# EAGLE design powerboard_v1 (EAGLE 7.2.0)
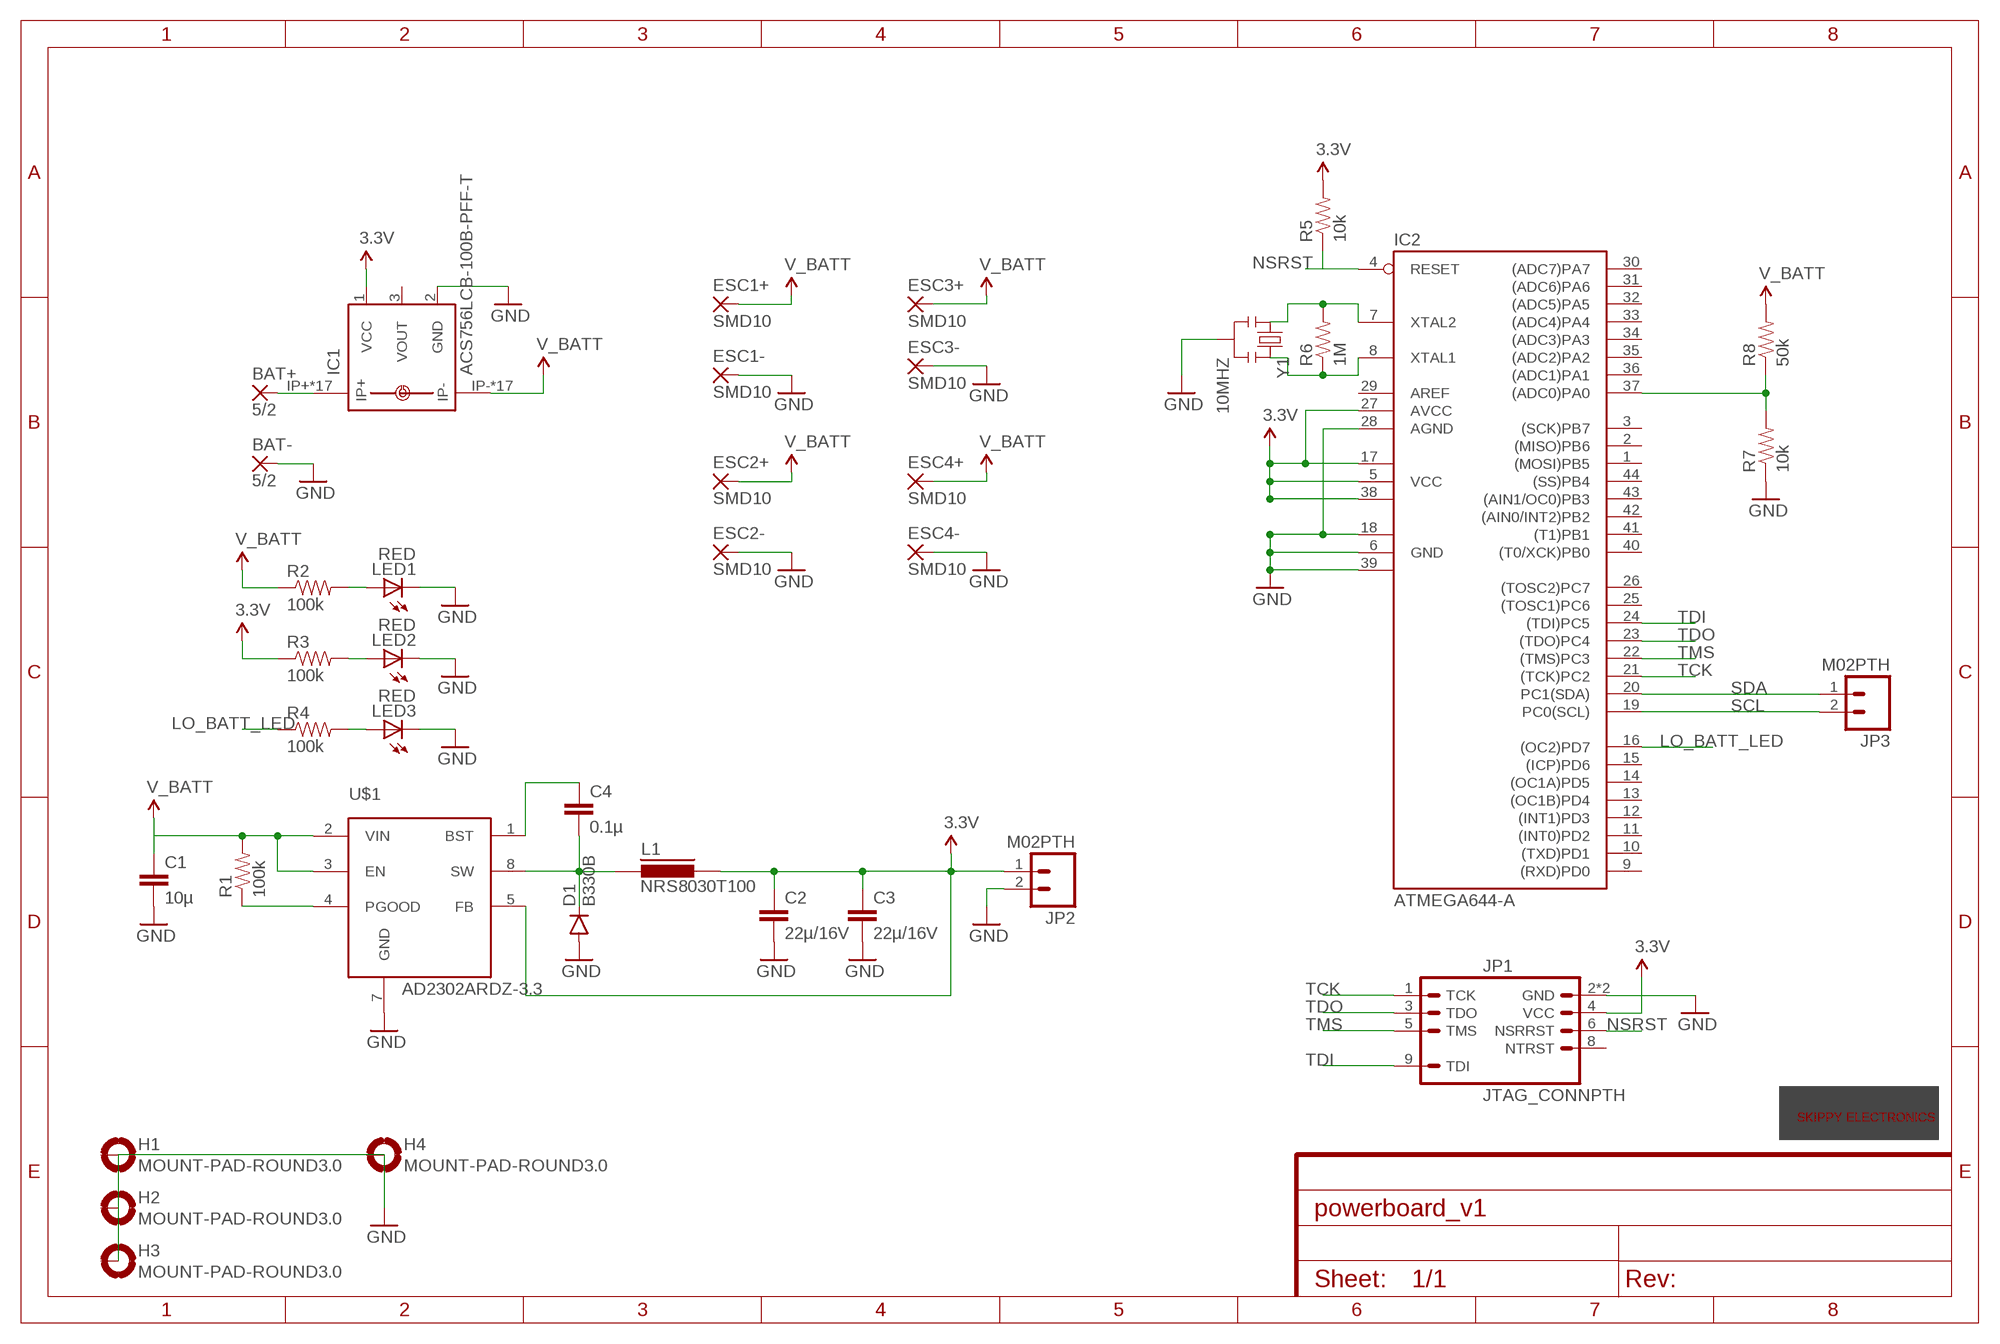
[diagram p0: schematic, sheet 1]
FRAME1 (FRAME-A4L): CNAME: SkippyElectronics; CREVISION: 1.0.0; DESIGNER: Christophe Huriaux

## Parts
BAT+  5/2  [5/2]
BAT-  5/2  [5/2]
C1  10µ  CAP1206  [1206]
C2  22µ/16V  CAP1206  [1206]
C3  22µ/16V  CAP1206  [1206]
C4  0.1µ  CAP1206  [1206]
D1  B330B  DIODESMB  [SMB-DIODE]
ESC1+  SMD10  [SMD5.08-10.16]
ESC1-  SMD10  [SMD5.08-10.16]
ESC2+  SMD10  [SMD5.08-10.16]
ESC2-  SMD10  [SMD5.08-10.16]
ESC3+  SMD10  [SMD5.08-10.16]
ESC3-  SMD10  [SMD5.08-10.16]
ESC4+  SMD10  [SMD5.08-10.16]
ESC4-  SMD10  [SMD5.08-10.16]
H1  MOUNT-PAD-ROUND3.0  [3,0-PAD]
H2  MOUNT-PAD-ROUND3.0  [3,0-PAD]
H3  MOUNT-PAD-ROUND3.0  [3,0-PAD]
H4  MOUNT-PAD-ROUND3.0  [3,0-PAD]
IC1  ACS756LCB-100B-PFF-T  [CB-PFF]
IC2  ATMEGA644-A  [TQFP44]
JP1  JTAG_CONNPTH  [AVR_ICSP]
JP2  M02PTH  [1X02]
JP3  M02PTH  [1X02]
L1  NRS8030T100  [NRS8030]
LED1  RED  LED_E  [LED_1206]
LED2  RED  LED_E  [LED_1206]
LED3  RED  LED_E  [LED_1206]
PLC1  SKIPPY-PLC-10MMPLC  [SKIPPY-PLC-10MM]
R1  100k  RESISTOR1206  [1206]
R2  100k  RESISTOR1206  [1206]
R3  100k  RESISTOR1206  [1206]
R4  100k  RESISTOR1206  [1206]
R5  10k  RESISTOR1206  [1206]
R6  1M  RESISTOR1206  [1206]
R7  10k  RESISTOR1206  [1206]
R8  50k  RESISTOR1206  [1206]
U$1  AD2302ARDZ-3.3  [SO8]
Y1  10MHZ  RESONATOR8MHZ  [RESONATOR-SMD]

## Nets
3.3V: C2.1 C3.1 IC1.1(VCC) IC2.5(VCC) IC2.17(VCC1) IC2.27(AVCC) IC2.38(VCC2) JP1.4(VCC) JP2.1 L1.P$2 R3.1 R5.2 U$1.5(FB)
GND: BAT-.P$1(P) C1.2 C2.2 C3.2 D1.A ESC1-.P$1(P) ESC1-.P$2(P) ESC2-.P$1(P) ESC2-.P$2(P) ESC3-.P$1(P) ESC3-.P$2(P) ESC4-.P$1(P) ESC4-.P$2(P) IC1.2(GND) IC2.6(GND) IC2.18(GND1) IC2.28(AGND) IC2.39(GND2) JP1.2(GND) JP1.10(GND) JP2.2 LED1.C LED2.C LED3.C R7.1 U$1.7(GND) Y1.2
LO_BATT_LED: IC2.16((OC2)PD7) R4.1
N$1: BAT+.P$1(P) IC1.IP+ IC1.IP+@2(IP+) IC1.IP+@3(IP+) IC1.IP+@4(IP+) IC1.IP+@5(IP+) IC1.IP+@6(IP+) IC1.IP+@7(IP+) IC1.IP+@8(IP+) IC1.IP+@9(IP+) IC1.IP+@10(IP+) IC1.IP+@11(IP+) IC1.IP+@12(IP+) IC1.IP+@13(IP+) IC1.IP+@14(IP+) IC1.IP+@15(IP+) IC1.IP+@16(IP+) IC1.IP+@17(IP+)
N$2: C4.2 D1.C L1.P$1 U$1.8(SW)
N$3: R1.1 U$1.4(PGOOD)
N$4: LED1.A R2.2
N$5: C4.1 U$1.1(BST)
N$6: LED2.A R3.2
N$7: LED3.A R4.2
N$8: IC2.7(XTAL2) R6.2 Y1.1
N$9: IC2.8(XTAL1) R6.1 Y1.3
N$10: IC2.37((ADC0)PA0) R7.2 R8.1
NSRST: IC2.4(RESET) JP1.6(NSRRST) R5.1
SCL: IC2.19(PC0(SCL)) JP3.2
SDA: IC2.20(PC1(SDA)) JP3.1
TCK: IC2.21((TCK)PC2) JP1.1(TCK)
TDI: IC2.24((TDI)PC5) JP1.9(TDI)
TDO: IC2.23((TDO)PC4) JP1.3(TDO)
TMS: IC2.22((TMS)PC3) JP1.5(TMS)
V_BATT: C1.1 ESC1+.P$1(P) ESC1+.P$2(P) ESC2+.P$1(P) ESC2+.P$2(P) ESC3+.P$1(P) ESC3+.P$2(P) ESC4+.P$1(P) ESC4+.P$2(P) IC1.IP- IC1.IP-@2(IP-) IC1.IP-@3(IP-) IC1.IP-@4(IP-) IC1.IP-@5(IP-) IC1.IP-@6(IP-) IC1.IP-@7(IP-) IC1.IP-@8(IP-) IC1.IP-@9(IP-) IC1.IP-@10(IP-) IC1.IP-@11(IP-) IC1.IP-@12(IP-) IC1.IP-@13(IP-) IC1.IP-@14(IP-) IC1.IP-@15(IP-) IC1.IP-@16(IP-) IC1.IP-@17(IP-) R1.2 R2.1 R8.2 U$1.2(VIN) U$1.3(EN)
Unconnected: H1.B3,0(MOUNT) H2.B3,0(MOUNT) H3.B3,0(MOUNT) H4.B3,0(MOUNT) IC1.3(VOUT) IC2.1((MOSI)PB5) IC2.2((MISO)PB6) IC2.3((SCK)PB7) IC2.9((RXD)PD0) IC2.10((TXD)PD1) IC2.11((INT0)PD2) IC2.12((INT1)PD3) IC2.13((OC1B)PD4) IC2.14((OC1A)PD5) IC2.15((ICP)PD6) IC2.25((TOSC1)PC6) IC2.26((TOSC2)PC7) IC2.29(AREF) IC2.30((ADC7)PA7) IC2.31((ADC6)PA6) IC2.32((ADC5)PA5) IC2.33((ADC4)PA4) IC2.34((ADC3)PA3) IC2.35((ADC2)PA2) IC2.36((ADC1)PA1) IC2.40((T0/XCK)PB0) IC2.41((T1)PB1) IC2.42((AIN0/INT2)PB2) IC2.43((AIN1/OC0)PB3) IC2.44((SS)PB4) JP1.8(NTRST)

## Library data of the parts
BAT+ BAT- = connectors:5/2
C1-C4 = SparkFun-Capacitors:CAP: Capacitor Standard 0603 ceramic capacitor, and 0.1" leaded capacitor.
D1 = SparkFun-DiscreteSemi:DIODE: Diode These are standard reverse protection diodes and small signal diodes. SMA package can handle up to about 1A. SOD-323 can handle about 200mA. What the SOD-323 package when ordering, there are some mfgs out there that are 5-pin packages.; PROD_ID: DIO-09646
ESC1+ ESC1- ESC2+ ESC2- ESC3+ ESC3- ESC4+ ESC4- = connectors:SMD10: SMD PAD
H1-H4 = holes:MOUNT-PAD-ROUND: MOUNTING PAD, round
IC1 = allegro:ACS756: Thermally Enhanced, Fully Integrated, Hall Effect-Based Linear Current Sensor with 100 micro Ohm Current Conductor display layer 49 Reference in BRD and place VIAs on circles Source: http://www.allegromicro.com/en/Products/Part_Numbers/0758/0758.pdf; MPN: ACS758LCB-100B-PFF-T; OC_FARNELL: 1718998; OC_NEWARK: 04R7132
IC2 = atmega:ATMEGA644: MICROCONTROLLER 32 Kbytes FLASH 2 Kbytes SRAM 1 Kbytes EEPROM USART 8-channel 10 bit ADC Source: avr.lbr; OC_FARNELL: unknown; OC_NEWARK: unknown
JP1 = connectors:JTAG_CONN: Header 5x2 Standard 10-pin dual row 0.1" header. Commonly used with AVR-ISP. Use with Spark Fun Electronics SKU: PRT-00778
JP2 JP3 = SparkFun-Connectors:M02: Standard 2-pin 0.1" header. Use with - straight break away headers ( PRT-00116) - right angle break away headers (PRT-00553) - swiss pins (PRT-00743) - machine pins (PRT-00117) - female headers (PRT-00115) Molex polarized connector foot print use with: PRT-08233 with associated crimp pins and housings. 2.54_SCREWTERM for use with PRT-10571. 3.5mm Screw Terminal footprints for PRT-08084 5mm Screw Terminal footprints for use with PRT-08432
L1 = inductors:NRS8030T100
LED1-LED3 = eagle-ltspice:LED_E: LED Source: http://www.osram.convergy.de Source: www.luxeon.com Source: www.kingbright.com; SPICEMODEL: NONE; SPICEPREFIX: D; SPICETYPE: diode
PLC1 = skippy-logo:SKIPPY-PLC-10MM
R1-R8 = SparkFun-Passives:RESISTOR: Resistor Basic schematic elements and footprints for 0603, 1206, and PTH resistors.
U$1 = dcdcconv:AD2302ARDZ-3.3
Y1 = SparkFun-FreqCtrl:RESONATOR: Resonator Small SMD resonator. Used, eg, on the Arduino Pro/ Pro Mini boards. 8MHz- XTAL-08895 16MHz- XTAL-08900; PROD_ID: XTAL-08895; VALUE: 8MHZ

## Board
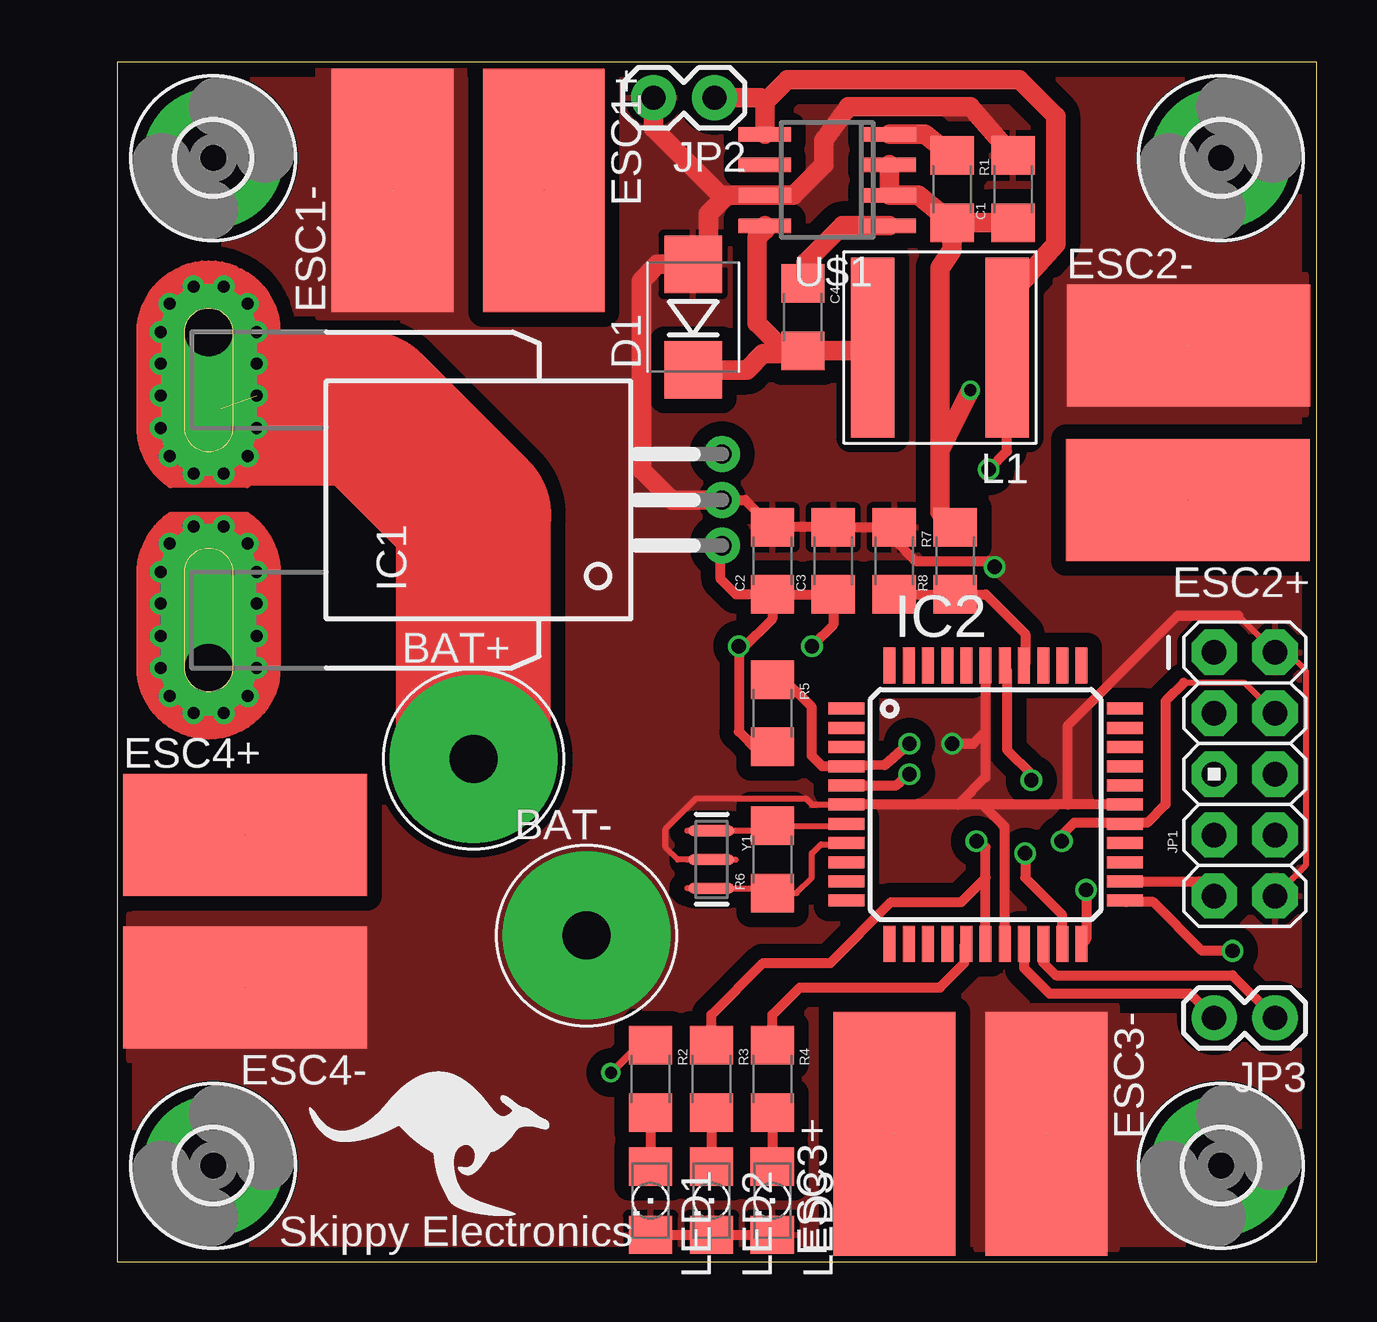
[diagram p1: board, top side]
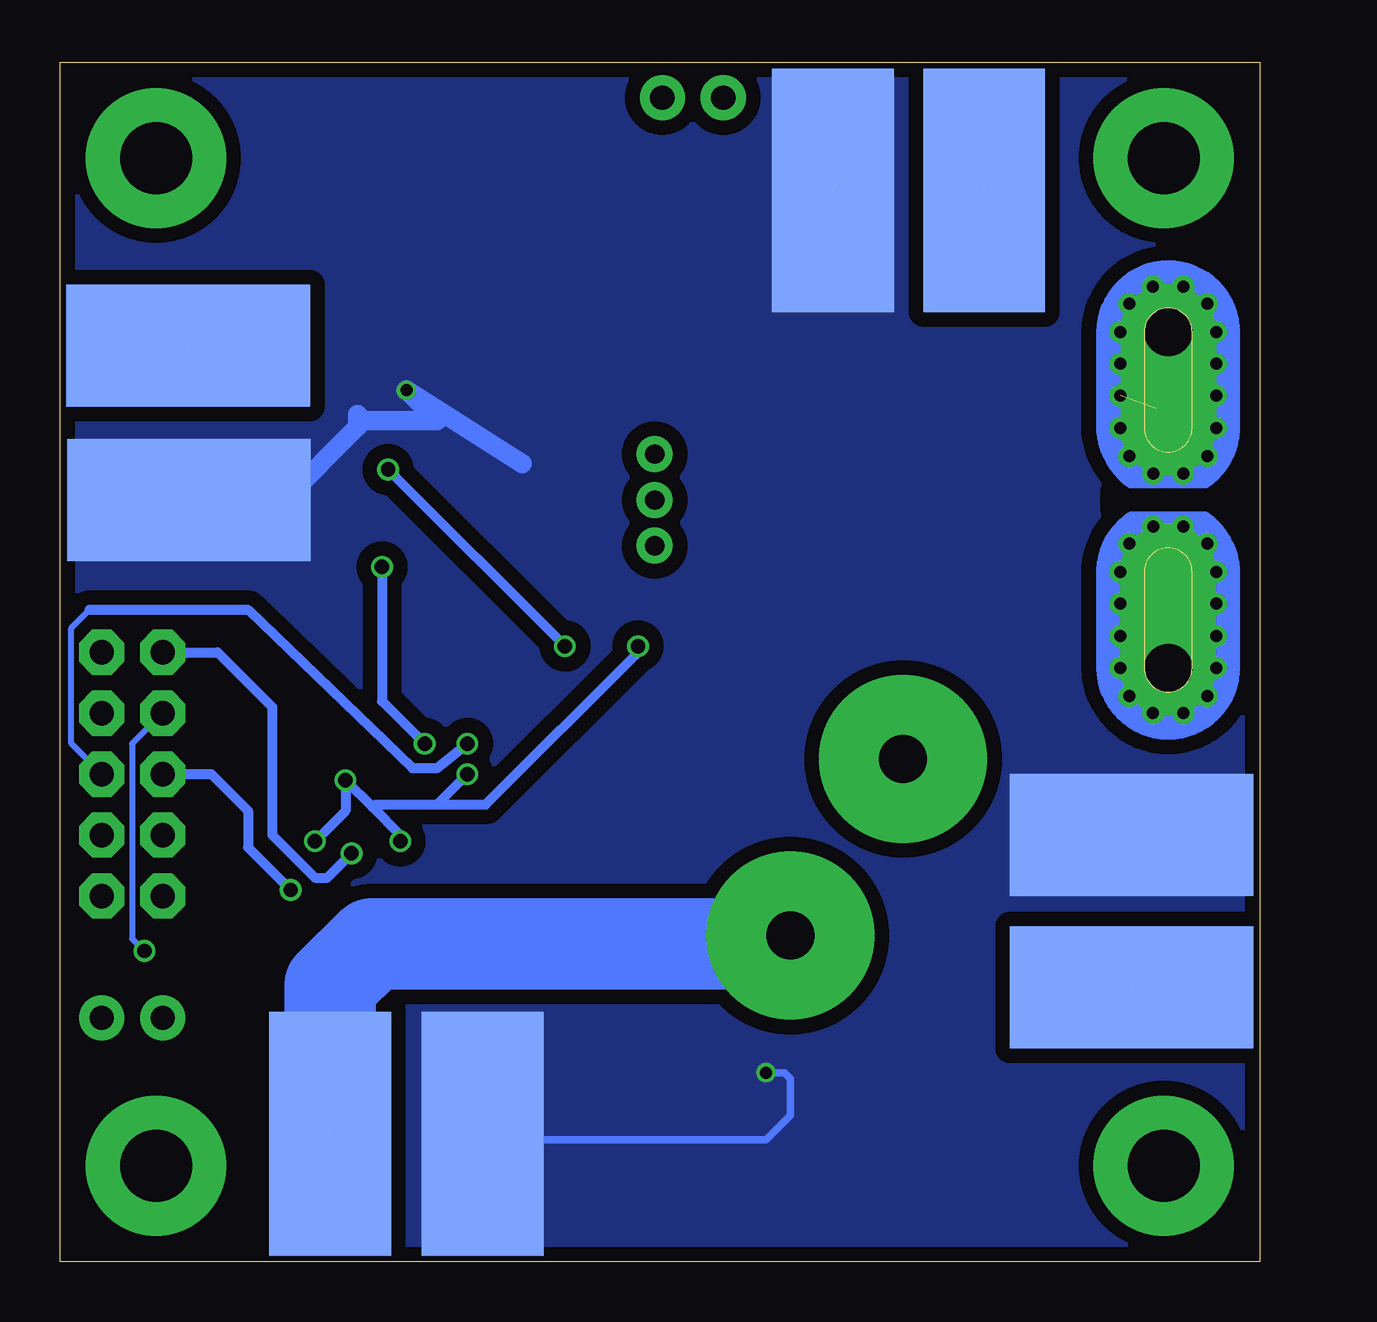
[diagram p2: board, bottom side, seen from below]

Size 50 x 50 mm. Coordinates in mm from the lower left corner, seen from the top.
Outline: 0,0 50,0 50,50 0,50 0,0
Copper layers (1*2*15*16): Top 0.035mm / dielectric 0.2mm / layer 2 0.0175mm / dielectric 1.1mm / layer 15 0.0175mm / dielectric 0.2mm / Bottom 0.035mm
Design rules "SeeedStudio_DRU_no_angle_20130527": minimum track width 6mil, minimum drill 12mil, track to track 6mil, track to pad 6mil, pad to pad 6mil, via to via 6mil, smd to smd 0mil, copper to edge 10mil, drill to drill 10mil, minimum pad ring 6mil, minimum via ring 6mil, stop-mask expansion 2mil, vias tented up to drill 25mil, thermal gap 10mil

### Footprints (pad centres in the part's own frame; a part is rotated, then mirrored left to right if it is on the bottom)
5/2 = drill 2 pad 7: P$1 0,0
1206 = smd 1.6 x 1.8: 1 -1.4,0; 2 1.4,0
SMB-DIODE = smd 2.4 x 2.4: A 2.2,0; C -2.2,0
SMD5.08-10.16 = smd 5.08 x 10.16 bottom: P$1 0,0 | smd 5.08 x 10.16: P$2 0,0
3,0-PAD = drill 3 pad 5.842: B3,0 0,0
CB-PFF = drill 0.8 pad 1.5: 1 -1.91,-21.4; 2 0,-21.4; 3 1.91,-21.4 | drill 2 pad 4 offset: IP+ 7,0; IP- -7,0 | drill 0.5 pad 0.9: IP+@2 8.89,0.635; IP+@3 8.89,-0.635; IP+@4 8.175,-1.625; IP+@5 7,-2; IP+@6 5.675,-2; IP+@7 4.35,-2; IP+@8 3,-2; IP+@9 1.825,-1.625; IP+@10 1.1,-0.625; IP+@11 1.1,0.625; IP+@12 1.825,1.625; IP+@13 3,2; IP+@14 4.35,2; IP+@15 5.675,2; IP+@16 7,2; IP+@17 8.175,1.625; IP-@2 -8.89,0.635; IP-@3 -8.89,-0.635; IP-@4 -8.175,-1.625; IP-@5 -7,-2; IP-@6 -5.675,-2; IP-@7 -4.325,-2; IP-@8 -3,-2; IP-@9 -1.825,-1.625; IP-@10 -1.1,-0.625; IP-@11 -1.1,0.625; IP-@12 -1.825,1.625; IP-@13 -3,2; IP-@14 -4.325,2; IP-@15 -5.675,2; IP-@16 -7,2; IP-@17 -8.175,1.625
TQFP44 = smd 1.5 x 0.5: 1 -5.8,4; 2 -5.8,3.2; 3 -5.8,2.4; 4 -5.8,1.6; 5 -5.8,0.8; 6 -5.8,0; 7 -5.8,-0.8; 8 -5.8,-1.6; 9 -5.8,-2.4; 10 -5.8,-3.2; 11 -5.8,-4; 23 5.8,-4; 24 5.8,-3.2; 25 5.8,-2.4; 26 5.8,-1.6; 27 5.8,-0.8; 28 5.8,0; 29 5.8,0.8; 30 5.8,1.6; 31 5.8,2.4; 32 5.8,3.2; 33 5.8,4 | smd 0.5 x 1.5: 12 -4,-5.8; 13 -3.2,-5.8; 14 -2.4,-5.8; 15 -1.6,-5.8; 16 -0.8,-5.8; 17 0,-5.8; 18 0.8,-5.8; 19 1.6,-5.8; 20 2.4,-5.8; 21 3.2,-5.8; 22 4,-5.8; 34 4,5.8; 35 3.2,5.8; 36 2.4,5.8; 37 1.6,5.8; 38 0.8,5.8; 39 0,5.8; 40 -0.8,5.8; 41 -1.6,5.8; 42 -2.4,5.8; 43 -3.2,5.8; 44 -4,5.8
AVR_ICSP = drill 1.016 pad 1.88 octagon: 1 -1.27,5.08; 2 1.27,5.08; 3 -1.27,2.54; 4 1.27,2.54; 5 -1.27,0; 6 1.27,0; 7 -1.27,-2.54; 8 1.27,-2.54; 9 -1.27,-5.08; 10 1.27,-5.08
1X02 = drill 1.016 pad 1.88: 1 0,0; 2 2.54,0
NRS8030 = smd 1.8 x 7.5: P$1 2.8,0; P$2 -2.8,0
LED_1206 = smd 1.6 x 1.803: A -1.422,0; C 1.422,0
SO8 = smd 0.6 x 2.2: 1 -1.905,-2.6; 2 -0.635,-2.6; 3 0.635,-2.6; 4 1.905,-2.6; 5 1.905,2.6; 6 0.635,2.6; 7 -0.635,2.6; 8 -1.905,2.6
RESONATOR-SMD = smd 0.45 x 1.905: 1 -1.2,0; 2 0,0; 3 1.2,0

### Placement (x,y rotation side)
BAT+  14.86,20.95 0 top
BAT-  19.56,13.59 0 top
C1  37.34,44.7 90 top
C2  27.3,29.21 90 top
C3  29.84,29.21 90 top
C4  28.57,39.37 270 top
D1  24,39.37 90 top
ESC1+  17.78,44.65 180 top
ESC1-  11.48,44.65 0 top
ESC2+  44.63,31.75 90 top
ESC2-  44.65,38.18 270 top
ESC3+  32.38,5.33 0 top
ESC3-  38.73,5.33 180 top
ESC4+  5.33,17.78 270 top
ESC4-  5.33,11.43 90 top
H1  4,46 0 top
H2  46,46 0 top
H3  4,4 0 top
H4  46,4 0 top
IC1  3.81,31.75 90 top
IC2  36.2,19.05 0 top
JP1  46.99,20.32 0 top
JP2  24.89,48.51 180 top
JP3  48.26,10.16 180 top
L1  34.29,38.1 180 top
LED1  22.23,2.54 270 top
LED2  24.77,2.54 270 top
LED3  27.3,2.54 270 top
PLC1  8,1.91 0 top
R1  34.8,44.7 270 top
R2  22.23,7.62 270 top
R3  24.77,7.62 270 top
R4  27.3,7.62 270 top
R5  27.3,22.86 270 top
R6  27.3,16.76 90 top
R7  32.38,29.21 270 top
R8  34.92,29.21 90 top
U$1  29.59,45.09 90 top
Y1  24.77,16.76 270 top

### Tracks (layer width: path | path; a pad name or v marks a point on that pad's centre or on a via)
3.3V  (via drill 0.6)
  Top 0.254: JP1.4 46.99,24.13 44.45,24.13 | 42.03,18.29 IC2.27
  Top 0.406: IC2.17 36.2,16 | 36.2,16 36.2,17.27 36.07,17.27 v35.81,17.53 | v39.37,17.53 39.37,17.78 39.88,18.29 41.91,18.29 IC2.27 | IC2.38 37.08,24.64 37.08,21.34 38.1,20.32 v38.1,20.07 | C2.1 C3.1 29.84,26.54 v28.96,25.65 | C2.1 27.3,26.8 26.04,25.53 | 26.04,25.53 25.91,25.4 25.91,22.1 26.67,21.34 27.18,21.34 R5.2 | v25.91,25.65 26.04,25.53 | R3.1 24.77,10.29 26.92,12.45 29.72,12.45 32.26,14.99 35.18,14.99 36.2,16 | 44.45,24.13 43.69,23.37 43.69,19.05 42.93,18.29 42.03,18.29 | IC2.5 32.47,19.85 v33.02,20.32 | C2.1 25.78,27.81 25.15,28.45 25.15,29.78 IC1.1 | v36.32,33.02 37.08,33.78 L1.P$2
  Top 0.813: L1.P$2 37.08,40.13 39.12,42.42 39.12,47.75 37.59,49.28 27.94,49.28 26.99,48.33 | U$1.5 26.99,48.33 | JP2.1 26.8,48.51 26.99,48.33
  Bottom 0.406: v35.81,17.53 35.81,17.78 36.96,18.92 | 36.96,18.92 v38.1,20.07 38.1,18.8 v39.37,17.53 | 34.29,19.05 36.83,19.05 36.96,18.92 | 34.29,19.05 32.26,19.05 25.91,25.4 v25.91,25.65 | v33.02,20.32 34.29,19.05 | v28.96,25.65 v36.32,33.02
GND  (via drill 0.6)  (4 unrouted)
  Top 0.254: JP1.10 49.53,16.51 49.53,24.64 48.77,25.4 JP1.2 46.74,26.92 | 23.75,16.76 23.37,16.76 22.86,17.27 22.86,18.03 24.13,19.3 28.7,19.3 28.96,19.05 IC2.6
  Top 0.406: IC1.2 26.16,31.75 C2.2 C3.2 R7.1 32.38,30.1 33.27,29.21 36.32,29.21 v36.58,28.96 | IC2.28 39.62,19.05 | 39.62,19.05 36.07,19.05 | 36.07,19.05 35.05,19.05 | 35.05,19.05 IC2.6 | IC2.18 36.99,18.12 36.07,19.05 | IC2.39 36.2,22.1 | 36.2,22.1 36.2,20.19 35.05,19.05 | LED1.C LED2.C LED3.C | 39.62,19.05 39.62,22.35 44.2,26.92 46.74,26.92 | v34.8,21.59 35.69,21.59 36.2,22.1
  Top 0.813: 25.4,44.45 U$1.7 28.19,44.45 29.46,45.72 29.46,46.74 30.48,48.13 35.56,48.13 C1.2 | 25.4,44.45 24.64,43.69 24.64,41.7 D1.A 22.52,41.57 21.84,40.89 21.84,33.02 23.11,31.75 IC1.2 | 25.4,44.45 25.15,44.45 22.35,47.24 JP2.2
  Bottom 0.406: v36.58,28.96 36.58,23.37 v34.8,21.59
  Bottom 3.81: ESC3-.P$1 38.73,11.51 IC2.18 20.41,13.25 BAT-.P$1
  pour Top (isolate 0.61): 0.51,49.53 49.53,49.53 49.53,45.97 49.53,0.51 0.51,0.51 0.51,8.64
  pour Top (no thermals): 8.38,49.78 8.38,39.37 14.48,39.37 14.48,49.78
  pour Top (no thermals): 39.62,41.15 49.53,41.15 49.53,35.31 39.12,35.31 39.12,40.89
  pour Top (no thermals): 35.81,10.67 41.66,10.67 41.66,0.51 35.81,0.51
  pour Top (no thermals): 0.51,14.48 10.92,14.48 10.92,8.64 10.92,8.38 0.51,8.38
  pour Top (no thermals): 15.75,15.24 16,16 17.78,17.53 21.08,17.53 22.86,15.75 22.86,15.24 23.37,14.73 23.37,11.94 22.1,10.67 21.34,10.67 20.57,9.91 18.03,9.91 15.75,12.19
LO_BATT_LED
  Top 0.406: R4.1 27.3,10.29 28.45,11.43 34.29,11.43 35.31,12.45 35.31,13.16 IC2.16
N$1  (1 unrouted)
  Top 6.452: BAT+.P$1 14.86,31.11 10.41,35.56 4.32,35.56 4.06,35.81
N$2
  Top 0.813: D1.C 26.25,37.17 26.92,37.85 27.94,37.85 | 27.94,37.85 28.45,37.85 C4.2 31.36,37.97 | U$1.8 26.99,42.99 26.67,42.67 26.67,39.12 27.94,37.85
  Top 1.676: 31.36,37.97 L1.P$1
N$3
  Top 0.813: U$1.4 33.66,46.99 R1.1
N$4
  Top 0.406: R2.2 LED1.A
N$5
  Top 0.813: U$1.1 30.23,43.18 28.7,41.66 28.7,40.9 C4.1
N$6
  Top 0.406: R3.2 LED2.A
N$7
  Top 0.406: R4.2 LED3.A
N$8
  Top 0.254: 25.78,17.96 27.11,17.96 R6.2 30.31,18.16 IC2.7
N$9
  Top 0.254: 25.78,15.56 27.11,15.56 R6.1 28.32,15.36 28.96,16 28.96,17.02 29.34,17.4 30.34,17.4 IC2.8
N$10
  Top 0.406: R7.2 R8.1 36.2,27.81 37.85,26.16 37.85,24.9 IC2.37
NSRST  (via drill 0.6)
  Top 0.406: R5.1 27.43,24.13 27.94,24.13 28.96,23.11 28.96,21.08 29.39,20.65 IC2.4 32,20.7 v33.02,21.59
  Bottom 0.254: JP1.6 49.53,21.59 49.53,26.42 48.77,27.18
  Bottom 0.406: 48.77,27.18 42.16,27.18 35.31,20.57 34.29,20.57 v33.02,21.59
SCL
  Top 0.406: IC2.19 37.8,12.24 38.86,11.18 44.7,11.18 JP3.2
SDA
  Top 0.406: IC2.20 38.59,12.46 39.12,11.94 46.48,11.94 JP3.1
TCK  (via drill 0.6)
  Top 0.406: v37.85,17.02 37.85,16 39.37,14.48 39.37,13.28 IC2.21
  Bottom 0.406: JP1.1 43.43,25.4 41.15,23.11 41.15,17.78 39.37,16 38.86,16 v37.85,17.02
TDI
  Top 0.406: IC2.24 45.11,15.85 JP1.9
TDO  (via drill 0.6)
  Top 0.254: 42.06,14.99 IC2.23
  Top 0.406: v46.48,12.95 45.21,12.95 43.18,14.99 42.06,14.99
  Bottom 0.254: JP1.3 46.99,21.59 46.99,13.46 v46.48,12.95
TMS  (via drill 0.6)
  Top 0.406: v40.39,15.49 40.39,13.44 IC2.22
  Bottom 0.406: JP1.5 43.69,20.32 42.16,18.8 42.16,17.27 v40.39,15.49
V_BATT  (via drill 0.5)  (4 unrouted)
  Top 0.305: R2.1 21.72,9.02 v20.57,7.87
  Top 0.813: U$1.3 U$1.2 33.4,44.45 R1.2 | C1.1 R1.2 | R1.2 34.8,42.16 34.29,41.4 34.29,33.78 | 34.29,33.78 34.29,31.25 | 34.29,31.25 R8.2 34.29,31.24 34.29,31.25 | 34.29,33.78 v35.56,36.32
  Bottom 0.305: v20.57,7.87 19.81,7.87 19.56,7.62 19.56,6.1 20.57,5.08 32.13,5.08 ESC3+.P$1
  Bottom 0.813: 30.73,33.27 v35.56,36.32 34.29,35.05 37.34,35.05 37.59,35.31 37.59,34.8 40.64,31.75 ESC2+.P$1
  pour Bottom (isolate 0.61, no thermals): 0.3,49.7 49.7,49.7 49.7,45.9 49.7,0.3 0.3,0.3 0.3,3.5